# EAGLE design redmaus-ir-tx-amp-mk-1.0 (EAGLE 7.5.0)
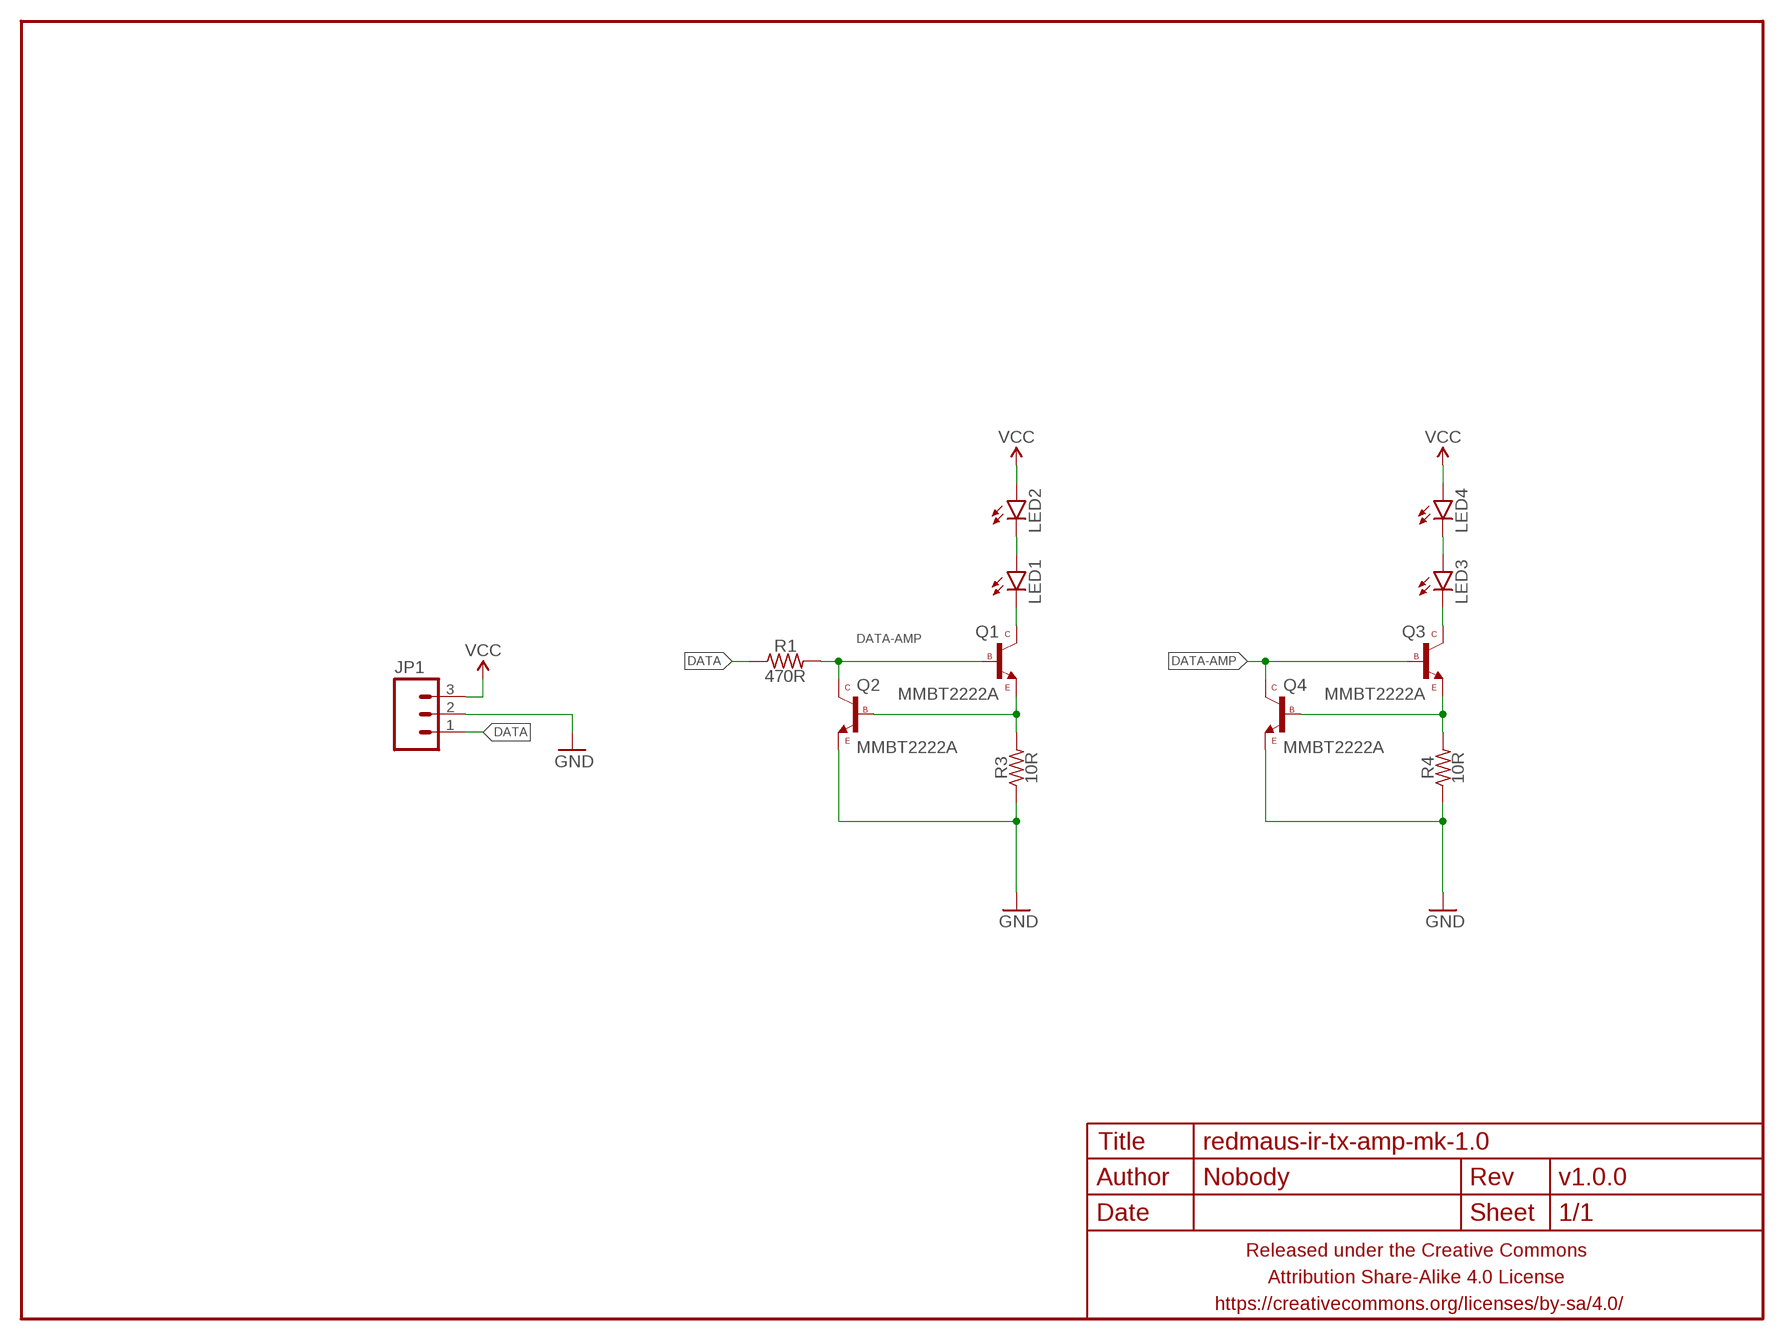
[diagram p0: schematic, sheet 1]

## Parts
FRAME1  FRAME-LETTERNO_PACKAGE  [DUMMY]
JP1  M03PTH-CENTERED  [1X03-CENTERED]
LED1  LED5MM_SHORTPADS  [LED5MM_SHORTPADS]
LED2  LED5MM_SHORTPADS  [LED5MM_SHORTPADS]
LED3  LED5MM_SHORTPADS  [LED5MM_SHORTPADS]
LED4  LED5MM_SHORTPADS  [LED5MM_SHORTPADS]
Q1  MMBT2222A  TRANSISTOR_NPNMMBT2222A  [SOT23]
Q2  MMBT2222A  TRANSISTOR_NPNMMBT2222A  [SOT23]
Q3  MMBT2222A  TRANSISTOR_NPNMMBT2222A  [SOT23]
Q4  MMBT2222A  TRANSISTOR_NPNMMBT2222A  [SOT23]
R1  470R  RESISTORR0603-TIGHTER  [R0603-TIGHTER]
R3  10R  RESISTORR0603-TIGHTER  [R0603-TIGHTER]
R4  10R  RESISTORR0603-TIGHTER  [R0603-TIGHTER]

## Nets
DATA: JP1.1 R1.1
DATA-AMP: Q1.1(B) Q2.3(C) Q3.1(B) Q4.3(C) R1.2
GND: JP1.2 Q2.2(E) Q4.2(E) R3.1 R4.1
N$1: LED1.A LED2.K(C)
N$2: LED3.K(C) Q3.3(C)
N$3: LED1.K(C) Q1.3(C)
N$4: Q1.2(E) Q2.1(B) R3.2
N$5: Q3.2(E) Q4.1(B) R4.2
N$6: LED3.A LED4.K(C)
VCC: JP1.3 LED2.A LED4.A

## Library data of the parts
FRAME1 = a_parts:FRAME-LETTER: Schematic Frame Standard 8.5x11 US Letter frame; DESIGNER: Nobody; VERSION: v1.0.0
JP1 = a_parts:M03: Header 3 Standard 3-pin 0.1" header. Use with straight break away headers (SKU : PRT-00116), right angle break away headers (PRT-00553), swiss pins (PRT-00743), machine pins (PRT-00117), and female headers (PRT-00115). Molex polarized connector foot print use with SKU : PRT-08232 with associated crimp pins and housings.
LED1-LED4 = a_parts:LED: LEDs Standard schematic elements and footprints for 5mm, 3mm, 1206, and 0603 sized LEDs. 5mm - Spark Fun Electronics SKU : COM-00529 (and others)
Q1-Q4 = a_parts:TRANSISTOR_NPN: Generic NPN BJT MMBT2222A - TRANS-08049 (SOT-23, 1A 40V) MPSA42 - TRANS-09116 (SOT-23, 500mA 300V) MMBT5088LT1G - TRANS-11160 (SOT-23, 50 mA 30V) BC547 - COM-08928 <http://www.sparkfun.com/products/8928> (TO-92 45V 100mA) (1.Collector 2.Base 3.Emitter) 2N3904 - COM-00521 <http://www.sparkfun.com/products/521> (TO-92 40V 200mA) (1.Emitter 2.Base 3.Collector) P2N2222A - COM-12852 <http://www.sparkfun.com/products/12852> (TO-92 40V 600mA) (1.Collector 2.Base 3.Emitter)
R1 R3 R4 = a_parts:RESISTOR: RESISTOR, American symbol

## Board
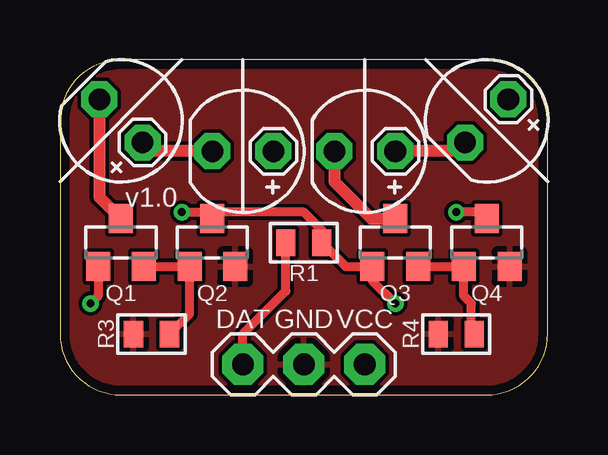
[diagram p1: board, top side]
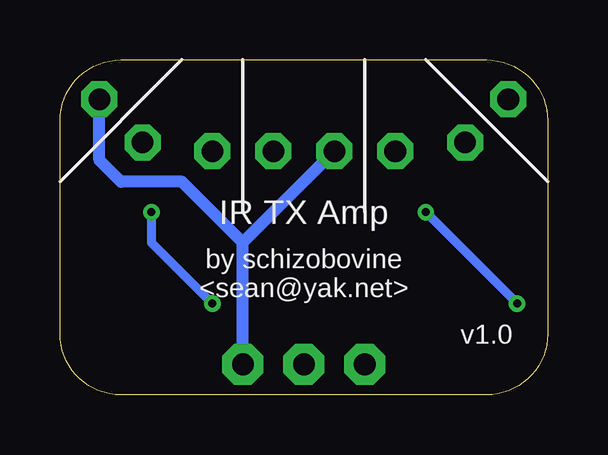
[diagram p2: board, bottom side, seen from below]

Size 20.32 x 13.97 mm. Coordinates in mm from the lower left corner, seen from the top.
Outline: 0,11.43 0,2.54 arc90 2.54,0 17.78,0 arc90 20.32,2.54 20.32,11.43 arc90 17.78,13.97 2.54,13.97 arc90 0,11.43
Copper layers (1*16): Top 0.0356mm / dielectric 1.5011mm / Bottom 0.0356mm
Design rules "LaenPCBOrder2": minimum track width 6mil, minimum drill 13mil, track to track 6mil, track to pad 6mil, pad to pad 6mil, via to via 6mil, smd to smd 6mil, copper to edge 15mil, drill to drill 6mil, minimum pad ring 7mil, minimum via ring 7mil, stop-mask expansion 3mil, vias tented up to drill 20mil, thermal gap 10mil

### Footprints (pad centres in the part's own frame; a part is rotated, then mirrored left to right if it is on the bottom)
1X03-CENTERED = drill 0.9 pad 1.7 octagon: 1 -2.54,0; 2 0,0; 3 2.54,0
LED5MM_SHORTPADS = drill 0.9 pad 1.5 octagon: A -1.27,0; K 1.27,0
SOT23 = smd 1 x 1.2: 1 -0.95,-1; 2 0.95,-1; 3 0,1
R0603-TIGHTER = smd 0.8 x 1.1: 1 -0.75,0; 2 0.75,0

### Placement (x,y rotation side)
FRAME1  0,0 0 top
JP1  10.16,1.27 0 top
LED1  2.54,11.43 135 top
LED2  7.62,10.16 180 top
LED3  12.7,10.16 180 top
LED4  17.78,11.43 225 top
Q1  2.54,6.35 0 top
Q2  6.35,6.35 0 top
Q3  13.97,6.35 0 top
Q4  17.78,6.35 0 top
R1  10.16,6.35 0 top
R3  3.81,2.54 0 top
R4  16.51,2.54 0 top

### Tracks (layer width: path | path; a pad name or v marks a point on that pad's centre or on a via)
DATA
  Top 0.381: JP1.1 7.62,2.54 9.41,4.33 R1.1
DATA-AMP  (via drill 0.33)
  Top 0.381: Q1.1 1.59,4.13 v1.27,3.81 | v5.08,7.62 6.08,7.62 Q2.3 6.35,7.62 10.16,7.62 10.91,6.87 R1.2 11.91,5.35 Q3.1 13.02,4.76 v13.97,3.81 | Q4.3 17.51,7.62 v16.51,7.62
  Bottom 0.381: v1.27,3.81 v5.08,7.62 | v16.51,7.62 16.51,6.35 v13.97,3.81
GND
  pour Top (rank 6): 0,11.43 0,2.54 arc90 2.54,0 17.78,0 arc90 20.32,2.54 20.32,11.43 arc90 17.78,13.97 2.54,13.97 arc90
N$1
  Top 0.508: LED2.K 3.81,10.16 LED1.A
N$2
  Top 0.508: LED3.K 11.43,8.89 12.97,7.35 Q3.3
N$3
  Top 0.508: LED1.K 1.64,8.25 Q1.3
N$4
  Top 0.381: Q1.2 Q2.1 5.4,3.38 R3.2
N$5
  Top 0.381: Q3.2 Q4.1 16.83,4.12 17.14,3.81 17.14,2.65 R4.2
N$6
  Top 0.508: LED4.K 16.51,10.16 LED3.A
VCC
  Bottom 0.508: JP1.3 12.7,6.35 | 12.7,6.35 LED2.A | 12.7,6.35 15.24,8.89 17.78,8.89 18.68,9.79 LED4.A

### Text on the board
tPlace: DAT | GND | VCC
bPlace: IR TX Amp | by schizobovine / <sean@yak.net>